# Altium schematic sheet Power15V0_1A.SchDoc
size 431 x 241 mm; SheetNumber: 1; SheetTotal: 1; SPICEModelCacheYXHJILDY: <root> / <DocumentId>YXHJILDY</DocumentId> / <CacheFrame Number="0"> / <Model Name="865230657013_100uf" Kind="CKT"> / <Text>******* / .subckt 865230657013_100uF 1 2 / Rser 1 3 0.189 / Lser 2 4 5.72884434804354E-09 / C1 3 4 0.0001 / Rpar 3 4 1000000 / .ends 865230657013_100uF</Text> / </Model> / <Model Name="861011483001_47uf" Kind="CKT"> / <Text>***** / .subckt 861011483001_47uF 1 2 / Rser 1 3 0.592 / Lser 2 4 1.3511713379E-08 / C1 3 4 0.000047 / Rpar 3 4 1063829.78723404 / .ends 861011483001_47uF</Text> / </Model> / </CacheFrame> / </root>
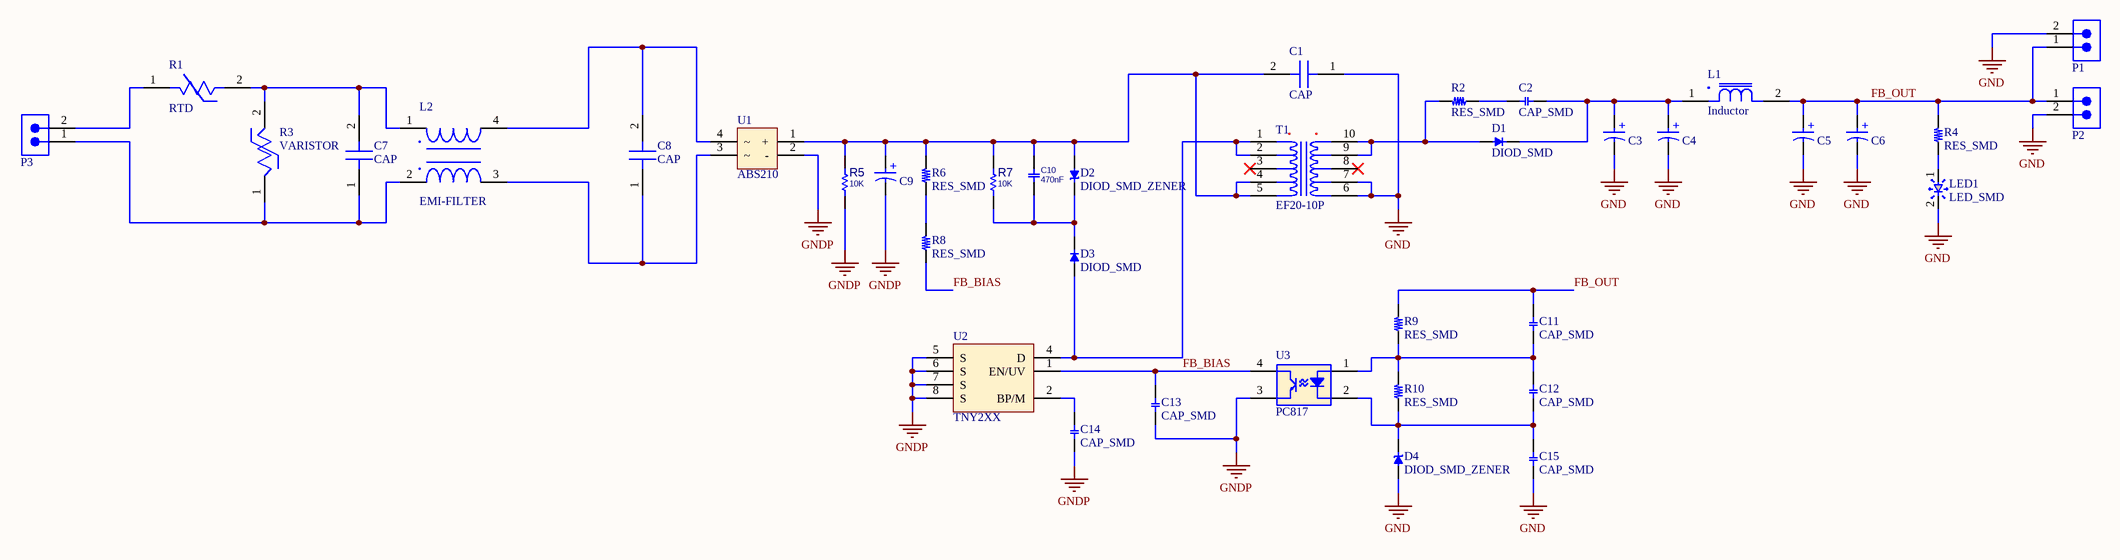
[diagram p0: Power15V0_1A.SchDoc]

## Parts
C1  CAP  [CXY]
C2  CAP_SMD  [C 1206]
C3  100µF  [WCAP-AS5H_D10H10.5]  (value not drawn)
C4  100µF  [WCAP-AS5H_D10H10.5]  (value not drawn)
C5  100µF  [WCAP-AS5H_D10H10.5]  (value not drawn)
C6  100µF  [WCAP-AS5H_D10H10.5]  (value not drawn)
C7  CAP  [CXY]
C8  CAP  [CXY]
C9  47µF  [WCAP-AIG8_D22H26]  (value not drawn)
C10  470nF  [C_PLY_6X3]
C11  CAP_SMD  [C 1206]
C12  CAP_SMD  [C 1206]
C13  CAP_SMD  [C 1206]
C14  CAP_SMD  [C 1206]
C15  CAP_SMD  [C 1206]
D1  DIOD_SMD  [DIOD_SMC]
D2  DIOD_SMD_ZENER  [DIOD_SMB]
D3  DIOD_SMD  [DIOD_SMB]
D4  DIOD_SMD_ZENER  [DIOD_SMA]
L1  Inductor  [L_12*12_SMD]
L2  EMI-FILTER  [EMI-FILTER-10*13]
LED1  LED_SMD  [D 1206]
P1  691322310002  [691322310002]  (value not drawn)
P2  691322310002  [691322310002]  (value not drawn)
P3  691322310002  [691322310002]  (value not drawn)
R1  RTD  [RTD]
R2  RES_SMD  [R 1206]
R3  VARISTOR  [RTD]
R4  RES_SMD  [R 1206]
R5  10K  [R025W_AX04]
R6  RES_SMD  [R 1206]
R7  10K  [R2W_AX_VER]
R8  RES_SMD  [R 1206]
R9  RES_SMD  [R 1206]
R10  RES_SMD  [R 1206]
T1  EF20-10P  [EF20-10P]
U1  ABS210  [ABS-4]
U2  TNY2XX  [PDIP-8C]
U3  PC817  [PSMD-4]

## Nets
GND: C1.1 C3.2(N) C4.2(N) C5.2(N) C6.2(N) C15.2 D4.1 LED1.2 P1.2 P2.2 T1.6 T1.7
GNDP: C9.2(N) C13.1 C14.1 R5.1 U1.2(-) U2.5(S) U2.6(S) U2.7(S) U2.8(S) U3.3(E)
FB_BIAS: C13.2 R8.1 U2.1(EN/UV) U3.4(C)
FB_OUT: C5.1(P) C6.1(P) C11.1 L1.2 P1.1 P2.1 R4.2 R9.2
NetC1_2: C1.2 C9.1(P) C10.2 D2.1 R5.2 R6.2 R7.2 T1.4 T1.5 U1.1(+)
NetC2_1: C2.1 C3.1(P) C4.1(P) D1.2 L1.1
NetC2_2: C2.2 R2.1
NetC7_1: C7.1 L2.2 P3.1 R3.1
NetC7_2: C7.2 L2.1 R1.2 R3.2
NetC8_1: C8.1 L2.3 U1.3
NetC8_2: C8.2 L2.4 U1.4
NetC10_1: C10.1 D2.2 D3.2 R7.1
NetC11_2: C11.2 C12.1 R9.1 R10.2 U3.1(A)
NetC12_2: C12.2 C15.1 D4.2 R10.1 U3.2(C)
NetC14_2: C14.2 U2.2(BP/M)
NetD1_1: D1.1 R2.2 T1.9 T1.10
NetD3_1: D3.1 T1.1 T1.2 U2.4(D)
NetLED1_1: LED1.1 R4.1
NetP3_2: P3.2 R1.1
NetR6_1: R6.1 R8.2

Not connected (* = marked no-connect by the designer): T1 3* 8*

## Notes on the sheet
- (near T1) .
- (in symbol 861011483001) +
- (in symbol 865230657013) +

## Library data of the parts
C3-C6 = 865230657013: WCAP-AS5H Aluminum Electrolytic Capacitor, V-Chip, D10 x H10.5mm, 100µF, 50V; Manufacturer: Wurth Elektronik; Capacitance Tolerance: +/-20%; Dissipation Factor: 12%; Endurance: 5000h; Leakage Current: 50µA; Ripple Current: 160mA; Technical Reference: ASDF105101M050DVCTEE000; Manufacturer Part Number: 865230657013; Category: Aluminum Electrolytic Capacitors; Match Code: WCAP-AS5H; ComponentLink1Description: Website Link; ComponentLink1URL: https://www.we-online.com/redexpert/article/865230657013?ad; ComponentLink2Description: Datasheet Link; ComponentLink2URL: https://www.we-online.com/redexpert/spec/865230657013?ad; Mount: Surface Mount; Operating Temperature Max: 105°C; Operating Temperature Min: -40°C; Packaging: Tape and Reel; Height: 10.5mm; Diameter: 10mm; Capacitance: 100µF; Rated Voltage (DC): 50V
C9 = 861011483001: WCAP-AIG8 Aluminum Electrolytic Capacitor, Snap-In, D22 x H26mm, 47µF, 450V; Manufacturer: Wurth Elektronik; Capacitance Tolerance: +/-20%; Dissipation Factor: 20%; Endurance: 2000h; Leakage Current: 423µA; Ripple Current: 360mA; Technical Reference: ANAN260470M450DSIC3B000; Manufacturer Part Number: 861011483001; Category: Aluminum Electrolytic Capacitors; Match Code: WCAP-AIG8; ComponentLink1Description: Website Link; ComponentLink1URL: https://www.we-online.com/redexpert/article/861011483001?ad; ComponentLink2Description: Datasheet Link; ComponentLink2URL: https://www.we-online.com/redexpert/spec/861011483001?ad; Mount: Through Hole; Operating Temperature Max: 85°C; Operating Temperature Min: -25°C; Packaging: Tray; Height: 26mm; Diameter: 22mm; Capacitance: 47µF; Rated Voltage (DC): 450V
C10 = CAP_THD_FILM_POLYESTER: CAP, FILM,; MANF_P#: MANF_PART#; PARAM2: 400V; PRICE: 100= 1$; DESC: CAP, FILM,; MANF: MANF; ASSEMBLY: ASSEMBLY; VALUE: 470nF
P1-P3 = 691322310002: WR-TBL Series 322 Horizontal PCB Header, Through Hole, pitch 3.81mm, 2p; Manufacturer: Wurth Elektronik; Pin Number: 2; Rated Current: 10A; Working Voltage: 300V; Modularity: No; ComponentLink1Description: Manufacturer Link; ComponentLink1URL: https://www.we-online.com/redexpert/article/691322310002?ad; ComponentLink2Description: Datasheet; ComponentLink2URL: https://www.we-online.com/redexpert/spec/691322310002?ad; Category: Terminal Blocks; Match Code: WR-TBL; Manufacturer Part Number: 691322310002; Mount: Through Hole; Operating Temperature Max: 105°C; Operating Temperature Min: -40°C; Packaging: Box; Pitch: 3.81mm; Orientation: Horizontal; Application: Pluggable; PCB/Cable/Panel: PCB
R5 R7 = RES_THD: RESISTOR, THD; MANF_P#: RK73H1ETTP4701F; MANF: KOA SPEER; PARAM: 0.063W; DESC: DESCRIPTION; DIST#: MOUSER; PARAM2: 1%; ASSEMBLY: ASSEMBLY; PRICE: 100= 0.5$; VALUE: 10K
U2 = TNY2XX: P Package (DIP-8C) / G Package (SMD-8C)